# EAGLE design shield (EAGLE 7.7.0)

## Sheet 1 of 2

## Sheet 2 of 2
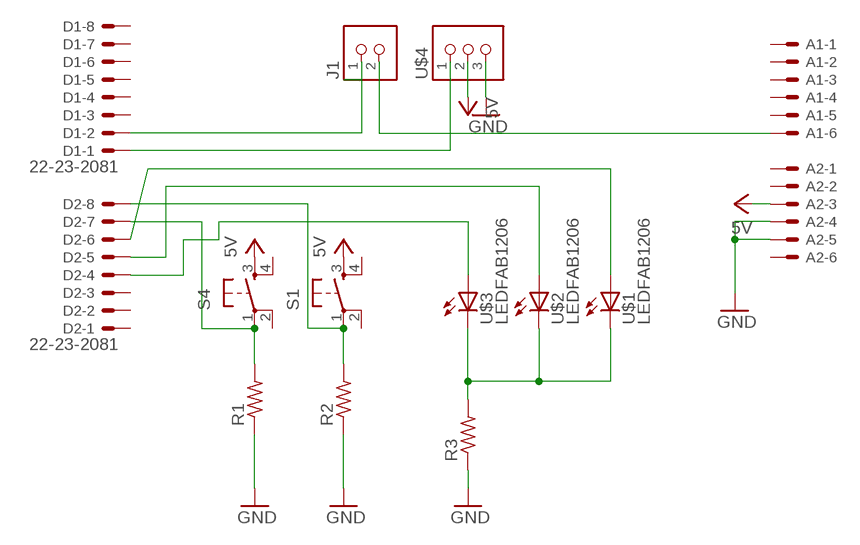
[diagram p0: schematic, sheet 2]

### Parts
A1  22-23-2061  [22-23-2061]
A2  22-23-2061  [22-23-2061]
D1  22-23-2081  [22-23-2081]
D2  22-23-2081  [22-23-2081]
J1  TERM-1X02-FABLAB  [ED555DS-2DS]
R1  RES-US1206FAB  [R1206FAB]
R2  RES-US1206FAB  [R1206FAB]
R3  RES-US1206FAB  [R1206FAB]
S1  6MM_SWITCH6MM_SWITCH  [6MM_SWITCH]
S4  6MM_SWITCH6MM_SWITCH  [6MM_SWITCH]
U$1  LEDFAB1206  [LED1206FAB]
U$2  LEDFAB1206  [LED1206FAB]
U$3  LEDFAB1206  [LED1206FAB]
U$4  TERM-1X03'-FABLAB'  [ED555DS-3DS]

### Nets
GND: A2.4 A2.5 R1.1 R2.1 R3.1 U$4.3
N$1: D2.8 R2.2 S1.1(P)
N$2: R3.2 U$1.2(C) U$2.2(C) U$3.2(C)
N$3: D2.7 R1.2 S4.1(P)
N$4: D1.2 J1.1
N$5: A1.6 J1.2
N$6: D2.6 U$1.1(A)
N$7: D2.5 U$2.1(A)
N$8: D2.4 U$3.1(A)
N$9: D1.1 U$4.1
VCC: A2.3 S1.3(S) S4.3(S) U$4.2 ; supply symbol labelled 5V
Unconnected: A1.1 A1.2 A1.3 A1.4 A1.5 A2.1 A2.2 A2.6 D1.3 D1.4 D1.5 D1.6 D1.7 D1.8 D2.1 D2.2 D2.3 S1.2(P1) S1.4(S1) S4.2(P1) S4.4(S1)

## Library data of the parts
A1 A2 = con-molex:22-23-2061: .100" (2.54mm) Center Header - 6 Pin; MF: MOLEX; MPN: 22-23-2061; OC_FARNELL: 1462922; OC_NEWARK: 27C1933
D1 D2 = con-molex:22-23-2081: .100" (2.54mm) Center Header - 8 Pin; MF: MOLEX; MPN: 22-23-2081; OC_FARNELL: 1756826; OC_NEWARK: 01C7592
J1 = fab:TERM-1X02: 3.5mm terminal block, 2 positions ED555-2DS as found in the fablab inventory. Stolen from Adafruit <http://www.ladyada.net/library/pcb/eaglelibrary.html>, adapted by Zaerc.
R1-R3 = fab:RES-US: Resistor (US Symbol) Variants with postfix FAB are widened to allow the routing of internal traces
S1 S4 = fab:6MM_SWITCH: OMRON SWITCH
U$1-U$3 = fab:LED: LED
U$4 = fab:TERM-1X03: 3.5mm terminal block, 3 positions ED555-3DS as found in the fablab inventory. Made by Zaerc.

## Board
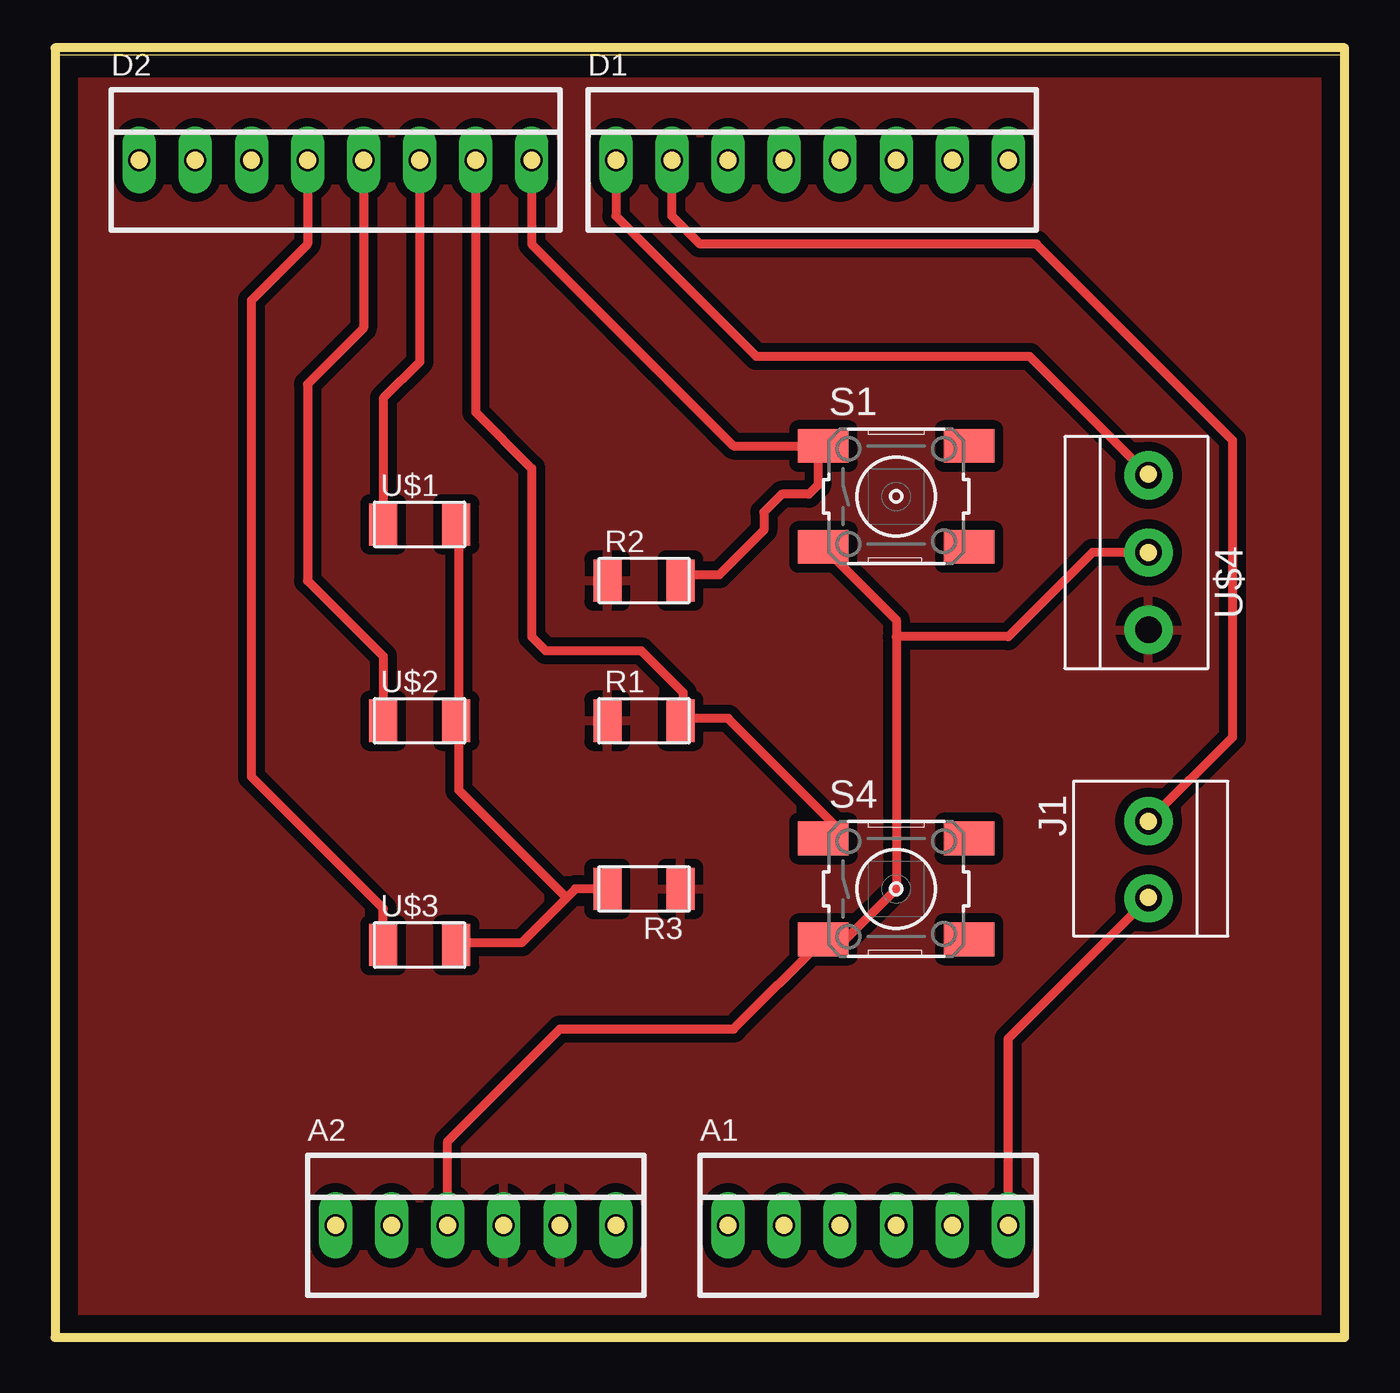
[diagram p1: board, top side]

Size 58.4 x 58.09 mm. Coordinates in mm from the lower left corner, seen from the top.
Outline: 0,0 58.4,0 58.4,58.09 0,58.09 0,0
Copper layers (1*16): Top 0.035mm / dielectric 1.5mm / Bottom 0.035mm
Design rules "default *": minimum track width 16mil, minimum drill 0.35mm, track to track 16mil, track to pad 16mil, pad to pad 16mil, via to via 16mil, smd to smd 16mil, copper to edge 40mil, drill to drill 6mil, minimum pad ring 10mil, minimum via ring 8mil, stop-mask expansion 4mil, vias tented up to drill 0mil, thermal gap 16mil
Holes 0.35 mm at 11.43,53.34 13.97,53.34 16.51,53.34 19.05,53.34 21.59,53.34 27.94,53.34 17.78,5.08 43.18,5.08 25.4,53.34 30.48,53.34 33.02,53.34 35.56,53.34 38.1,53.34 40.64,53.34 43.18,53.34 8.89,53.34 6.35,53.34 3.81,53.34 22.86,5.08 20.32,5.08 25.4,5.08 15.24,5.08 12.7,5.08 30.48,5.08 33.02,5.08 35.56,5.08 38.1,5.08 40.64,5.08
Milling: area 3.6,53.2 to 4,53.5; area 6.2,53.2 to 6.5,53.5; area 8.7,53.2 to 9.1,53.5; area 11.3,53.2 to 11.6,53.5; area 13.8,53.2 to 14.1,53.5; area 16.3,53.2 to 16.7,53.5; area 18.9,53.2 to 19.2,53.5; area 21.4,53.2 to 21.8,53.5; area 25.2,53.2 to 25.6,53.5; area 27.8,53.2 to 28.1,53.5; area 30.3,53.2 to 30.7,53.5; area 32.8,53.2 to 33.2,53.5; 20 more areas; 4 lines

### Footprints (pad centres in the part's own frame; a part is rotated, then mirrored left to right if it is on the bottom)
22-23-2061 = drill 1 long: 1 -6.35,0; 2 -3.81,0; 3 -1.27,0; 4 1.27,0; 5 3.81,0; 6 6.35,0
22-23-2081 = drill 1 long: 1 -8.89,0; 2 -6.35,0; 3 -3.81,0; 4 -1.27,0; 5 1.27,0; 6 3.81,0; 7 6.35,0; 8 8.89,0
ED555DS-2DS = drill 1.2 pad 2.184: 1 1.8,0; 2 -1.7,0
R1206FAB = smd 1.27 x 1.905: 1 -1.651,0; 2 1.651,0
6MM_SWITCH = smd 2.286 x 1.524: 1 -3.302,2.286; 2 3.302,2.286; 3 -3.302,-2.286; 4 3.302,-2.286
LED1206FAB = smd 1.27 x 1.905: 1 -1.651,0; 2 1.651,0
ED555DS-3DS = drill 1.2 pad 2.184: 1 -3.5,0; 2 0,0; 3 3.5,0

### Placement (x,y rotation side)
A1  36.83,5.08 0 top
A2  19.05,5.08 0 top
D1  34.29,53.34 0 top
D2  12.7,53.34 0 top
J1  49.53,21.59 90 top
R1  26.67,27.94 0 top
R2  26.67,34.29 0 top
R3  26.67,20.32 180 top
S1  38.1,38.1 0 top
S4  38.1,20.32 0 top
U$1  16.51,36.83 0 top
U$2  16.51,27.94 0 top
U$3  16.51,17.78 0 top
U$4  49.53,35.56 270 top

### Tracks (layer width: path | path; a pad name or v marks a point on that pad's centre or on a via)
GND
  pour Top (isolate 0.406): 0,0 58.42,0 58.42,58.42 0,58.42
N$1
  Top 0.406: 34.54,40.23 34.54,38.61 34.14,38.2 32.92,38.2 32.11,37.39 32.11,36.58 30.07,34.54 28.45,34.54 R2.2 | 34.54,40.23 S1.1 30.73,40.39 21.59,49.53 D2.8 | 34.54,40.39 34.54,40.23
N$2
  Top 0.406: 23.16,19.91 23.57,20.32 R3.2 | 23.16,19.91 21.13,17.88 18.29,17.88 U$3.2 | 23.16,19.91 18.29,24.79 18.29,27.64 U$2.2 18.29,28.04 18.29,36.58 U$1.2
N$3
  Top 0.406: 28.45,28.04 30.48,28.04 35.36,23.16 35.36,22.76 34.95,22.35 S4.1 | 28.45,28.04 R1.2 | 28.45,28.04 28.45,29.21 26.54,31.11 22.23,31.11 21.59,31.75 21.59,39.37 19.05,41.91 D2.7
N$4
  Top 0.406: J1.1 53.34,27.2 53.34,40.64 44.45,49.53 29.21,49.53 27.94,50.8 D1.2
N$5
  Top 0.406: A1.6 43.18,13.54 J1.2
N$6
  Top 0.406: D2.6 16.51,44.2 14.86,42.55 U$1.1
N$7
  Top 0.406: U$2.1 14.86,30.86 11.43,34.29 11.43,43.18 13.97,45.72 D2.5
N$8
  Top 0.406: U$3.1 14.86,19.43 8.89,25.4 8.89,46.99 11.43,49.53 D2.4
N$9
  Top 0.406: D1.1 25.4,50.8 31.75,44.45 44.14,44.45 U$4.1
VCC
  Top 0.406: S1.3 38.1,32.51 38.1,31.75 | 38.1,31.75 38.1,20.32 35.56,17.78 35.05,17.78 S4.3 30.73,13.97 22.86,13.97 17.78,8.89 A2.3 | U$4.2 46.99,35.56 43.18,31.75 38.1,31.75